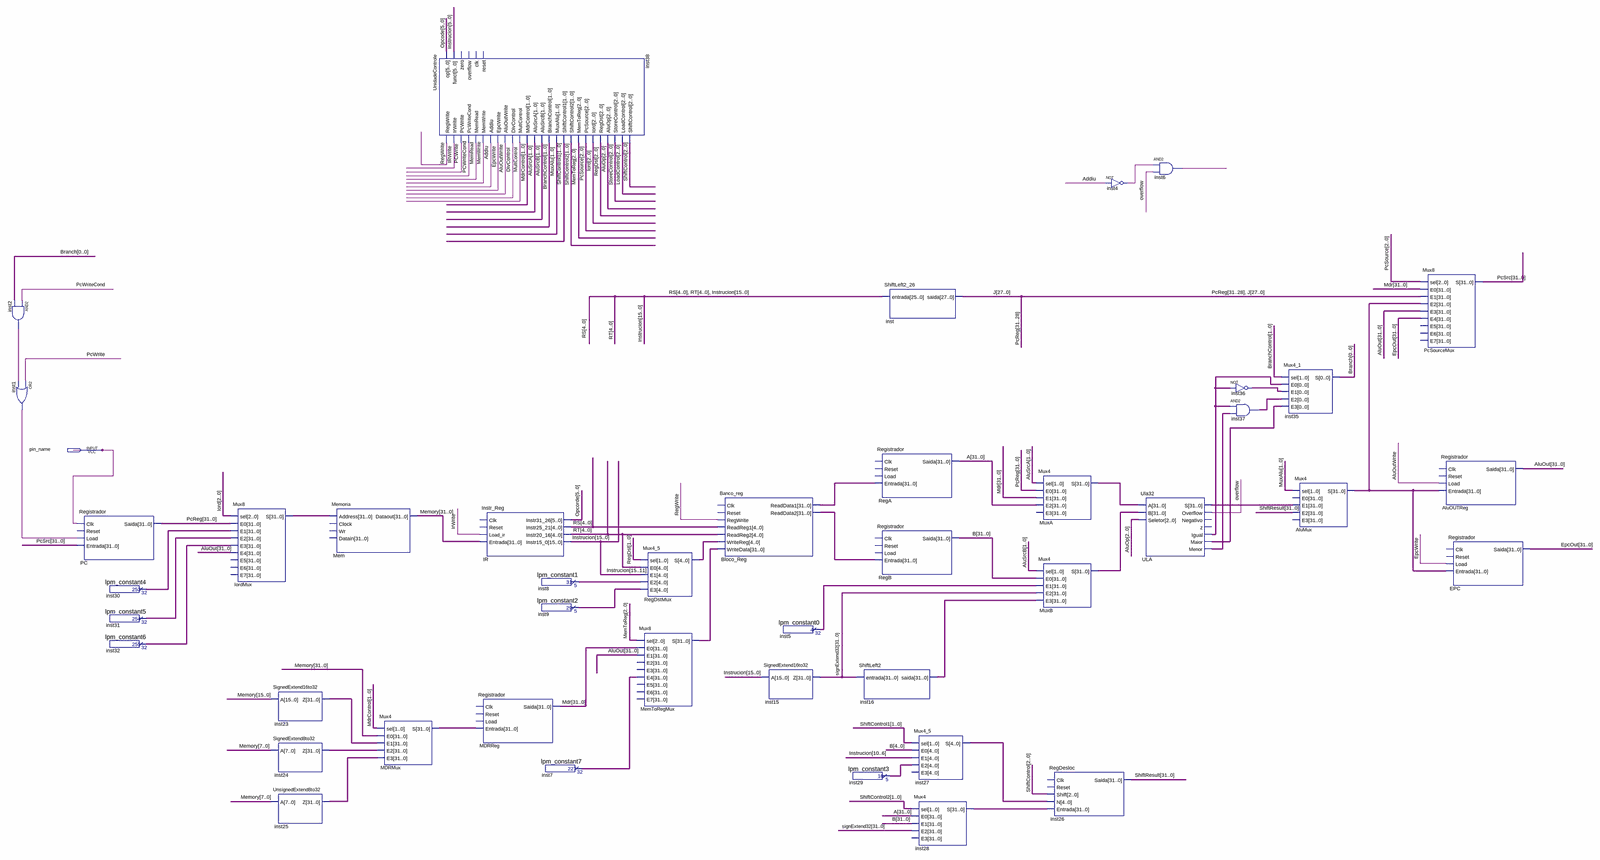
[diagram p0: schematic sheet, whole]
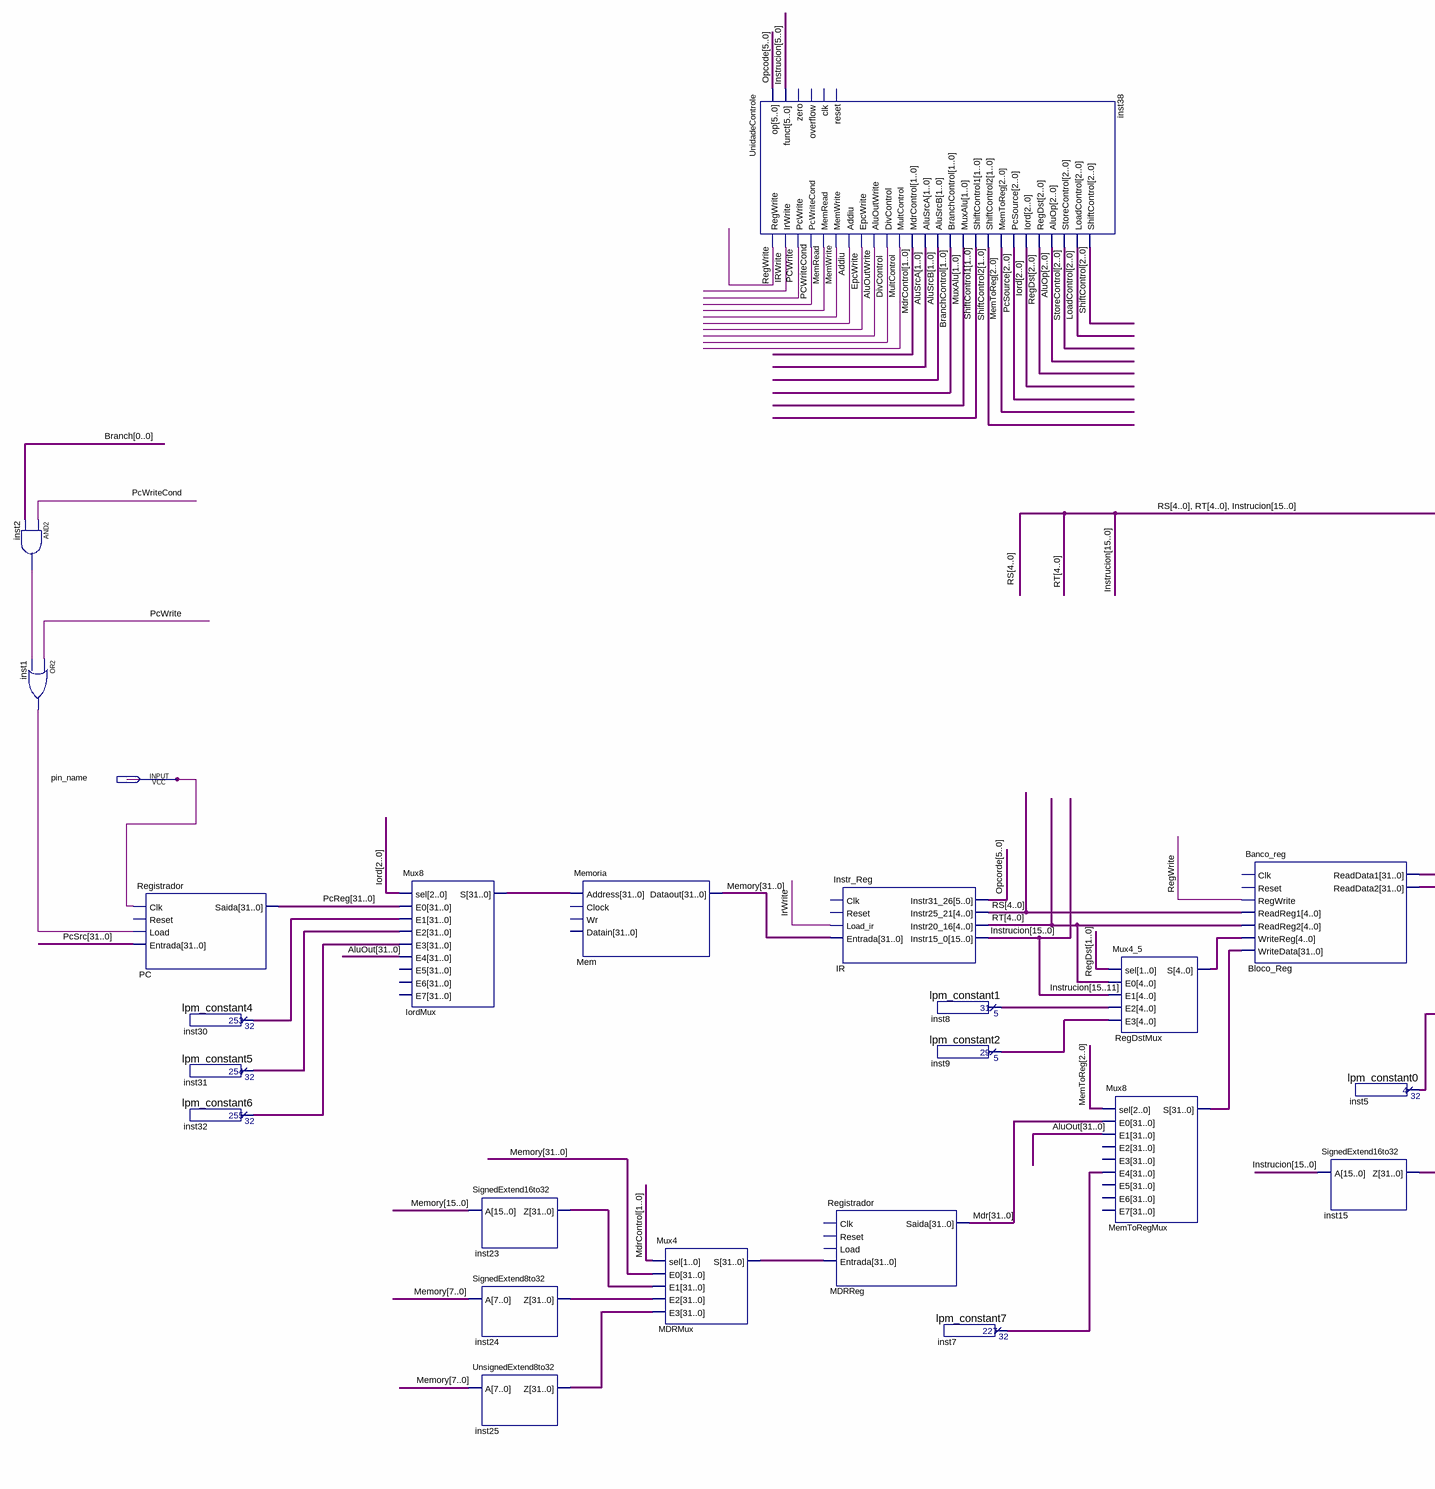
[diagram p1: schematic sheet, left part]
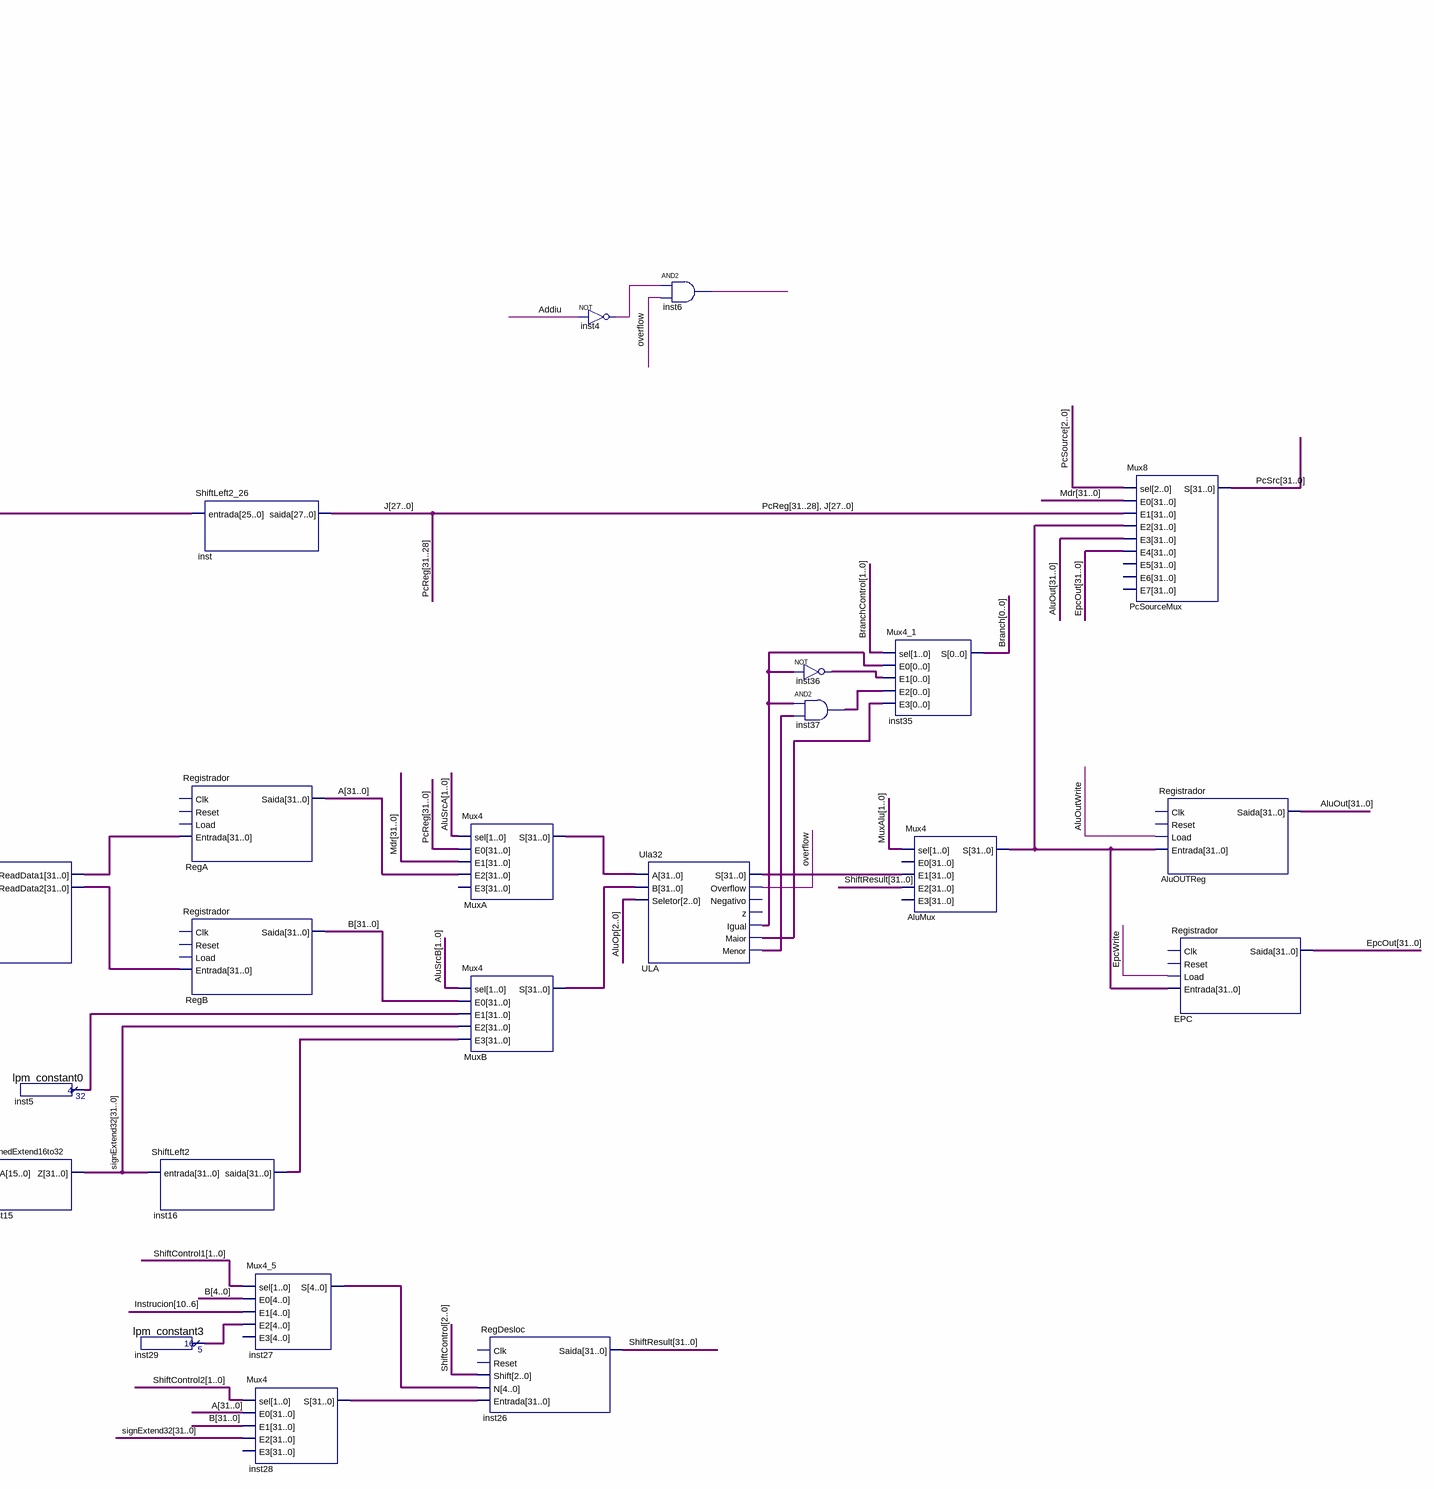
[diagram p2: schematic sheet, right part]
// Quartus schematic Projeto.bdf as structural Verilog: 43 symbols, 1 pins
module Projeto (
  input  pin_name
);

  wire Addiu, AluOutWrite, DivControl, EpcWrite, inst1_out, inst2_out, inst4_out, inst6_out, inst36_out,
       inst37_out, IRWrite, MemRead, MemWrite, MultControl, overflow, PCWrite, PCWriteCond, RegWrite,
       ULA_igual, ULA_maior, ULA_menor;
  wire [0:0] Branch;
  wire [1:0] AluSrcA, AluSrcB, BranchControl, MdrControl, MuxAlu, ShiftControl1, ShiftControl2;
  wire [2:0] AluOp, Iord, LoadControl, MemToReg, PcSource, RegDst, ShiftControl, StoreControl;
  wire [4:0] inst8_result, inst9_result, inst27_s, inst29_result, RegDstMux_s, RS, RT;
  wire [5:0] Opcode, Opcorde;
  wire [15:0] Instrucion;
  wire [27:0] J;
  wire [31:0] A, AluMux_s, AluOut, B, Bloco_Reg_readdata1, Bloco_Reg_readdata2, EpcOut, inst5_result,
       inst7_result, inst16_saida, inst23_z, inst24_z, inst25_z, inst28_s, inst30_result, inst31_result,
       inst32_result, IordMux_s, Mdr, MDRMux_s, Memory, MemToRegMux_s, MuxA_s, MuxB_s, PcReg, PcSrc,
       ShiftResult, signExtend32, ULA_s;

  and inst2 (inst2_out, PCWriteCond, Branch[0]);
  or inst1 (inst1_out, PCWrite, inst2_out);
  Registrador PC (.Clk(pin_name), .Load(inst1_out), .Entrada(PcSrc), .Saida(PcReg));  // open: Reset
  lpm_constant4 inst30 (.result(inst30_result));
  lpm_constant5 inst31 (.result(inst31_result));
  lpm_constant6 inst32 (.result(inst32_result));
  Mux8 IordMux (
    .sel(Iord), .E0(PcReg), .E1(inst30_result), .E2(inst31_result), .E3(inst32_result), .E4(AluOut),
    .S(IordMux_s));  // open: E5, E6, E7
  SignedExtend16to32 inst23 (.A(Memory[15:0]), .Z(inst23_z));
  SignedExtend8to32 inst24 (.A(Memory[7:0]), .Z(inst24_z));
  UnsignedExtend8to32 inst25 (.A(Memory[7:0]), .Z(inst25_z));
  Memoria Mem (.Address(IordMux_s), .Dataout(Memory));  // open: Clock, Wr, Datain
  Mux4 MDRMux (.sel(MdrControl), .E0(Memory), .E1(inst23_z), .E2(inst24_z), .E3(inst25_z), .S(MDRMux_s));
  UnidadeControle inst38 (
    .op(Opcode), .funct(Instrucion[5:0]), .RegWrite(RegWrite), .IrWrite(IRWrite), .PcWrite(PCWrite),
    .PcWriteCond(PCWriteCond), .MemRead(MemRead), .MemWrite(MemWrite), .Addiu(Addiu), .EpcWrite(EpcWrite),
    .AluOutWrite(AluOutWrite), .DivControl(DivControl), .MultControl(MultControl), .MdrControl(MdrControl),
    .AluSrcA(AluSrcA), .AluSrcB(AluSrcB), .BranchControl(BranchControl), .MuxAlu(MuxAlu),
    .ShiftControl1(ShiftControl1), .ShiftControl2(ShiftControl2), .MemToReg(MemToReg), .PcSource(PcSource),
    .Iord(Iord), .RegDst(RegDst), .AluOp(AluOp), .StoreControl(StoreControl), .LoadControl(LoadControl),
    .ShiftControl(ShiftControl));  // open: zero, overflow, clk, reset
  Instr_Reg IR (
    .Load_ir(IRWrite), .Entrada(Memory), .Instr31_26(Opcorde), .Instr25_21(RS), .Instr20_16(RT),
    .Instr15_0(Instrucion));  // open: Clk, Reset
  Registrador MDRReg (.Entrada(MDRMux_s), .Saida(Mdr));  // open: Clk, Reset, Load
  lpm_constant1 inst8 (.result(inst8_result));
  lpm_constant2 inst9 (.result(inst9_result));
  lpm_constant7 inst7 (.result(inst7_result));
  Mux4_5 RegDstMux (
    .sel(RegDst[1:0]), .E0(RT), .E1(Instrucion[15:11]), .E2(inst8_result), .E3(inst9_result), .S(RegDstMux_s));
  Mux8 MemToRegMux (
    .sel(MemToReg), .E0(Mdr), .E1(AluOut), .E4(inst7_result), .S(MemToRegMux_s));  // open: E2, E3, E5, E6, E7
  Banco_reg Bloco_Reg (
    .RegWrite(RegWrite), .ReadReg1(RS), .ReadReg2(RT), .WriteReg(RegDstMux_s), .WriteData(MemToRegMux_s),
    .ReadData1(Bloco_Reg_readdata1), .ReadData2(Bloco_Reg_readdata2));  // open: Clk, Reset
  SignedExtend16to32 inst15 (.A(Instrucion), .Z(signExtend32));
  lpm_constant0 inst5 (.result(inst5_result));
  ShiftLeft2 inst16 (.entrada(signExtend32), .saida(inst16_saida));
  lpm_constant3 inst29 (.result(inst29_result));
  ShiftLeft2_26 inst (.entrada({RS, RT, Instrucion}), .saida(J));
  Registrador RegA (.Entrada(Bloco_Reg_readdata1), .Saida(A));  // open: Clk, Reset, Load
  Registrador RegB (.Entrada(Bloco_Reg_readdata2), .Saida(B));  // open: Clk, Reset, Load
  Mux4_5 inst27 (
    .sel(ShiftControl1), .E0(B[4:0]), .E1(Instrucion[10:6]), .E2(inst29_result), .S(inst27_s));  // open: E3
  Mux4 inst28 (.sel(ShiftControl2), .E0(A), .E1(B), .E2(signExtend32), .S(inst28_s));  // open: E3
  Mux4 MuxA (.sel(AluSrcA), .E0(PcReg), .E1(Mdr), .E2(A), .S(MuxA_s));  // open: E3
  Mux4 MuxB (.sel(AluSrcB), .E0(B), .E1(inst5_result), .E2(signExtend32), .E3(inst16_saida), .S(MuxB_s));
  RegDesloc inst26 (.Shift(ShiftControl), .N(inst27_s), .Entrada(inst28_s), .Saida(ShiftResult));  // open: Clk, Reset
  not inst4 (inst4_out, Addiu);
  and inst6 (inst6_out, inst4_out, overflow);
  Ula32 ULA (
    .A(MuxA_s), .B(MuxB_s), .Seletor(AluOp), .S(ULA_s), .Overflow(overflow), .Igual(ULA_igual),
    .Maior(ULA_maior), .Menor(ULA_menor));  // open: Negativo, z
  not inst36 (inst36_out, ULA_igual);
  and inst37 (inst37_out, ULA_igual, ULA_menor);
  Mux4_1 inst35 (.sel(BranchControl), .E0(ULA_igual), .E1(inst36_out), .E2(inst37_out), .E3(ULA_maior), .S(Branch[0]));
  Mux4 AluMux (.sel(MuxAlu), .E1(ULA_s), .E2(ShiftResult), .S(AluMux_s));  // open: E0, E3
  Mux8 PcSourceMux (
    .sel(PcSource), .E0(Mdr), .E1({PcReg[31:28], J}), .E2(AluMux_s), .E3(AluOut), .E4(EpcOut), .S(PcSrc));  // open: E5, E6, E7
  Registrador AluOUTReg (.Load(AluOutWrite), .Entrada(AluMux_s), .Saida(AluOut));  // open: Clk, Reset
  Registrador EPC (.Load(EpcWrite), .Entrada(AluMux_s), .Saida(EpcOut));  // open: Clk, Reset
endmodule
